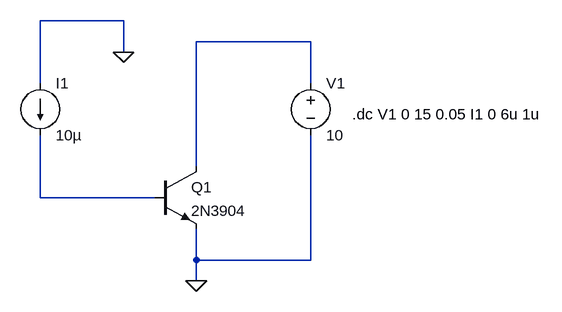
[diagram p0: schematic BJT_IV_trace copy.asc]
BJT_IV_trace copy.asc, the LTspice schematic file:
Version 4
SHEET 1 1000 680
WIRE 272 176 144 176
WIRE 560 208 384 208
WIRE 272 224 272 176
WIRE 144 272 144 176
WIRE 560 272 560 208
WIRE 384 400 384 208
WIRE 144 448 144 352
WIRE 320 448 144 448
WIRE 384 544 384 496
WIRE 560 544 560 352
WIRE 560 544 384 544
WIRE 384 576 384 544
FLAG 384 576 0
FLAG 272 224 0
SYMBOL current 144 272 R0
SYMATTR InstName I1
SYMATTR Value 10µ
SYMBOL Voltage 560 256 R0
SYMATTR InstName V1
SYMATTR Value 10
SYMBOL npn 320 400 R0
SYMATTR InstName Q1
SYMATTR Value 2N3904
TEXT 624 320 Left 2 !.dc V1 0 15 0.05 I1 0 6u 1u

The netlist it stands for:
* BJT_IV_trace copy.asc
I1 0 N002 10µ
V1 N001 0 10
Q1 N001 N002 0 0 2N3904
.model NPN NPN
.model PNP PNP
.lib standard.bjt
.dc V1 0 15 0.05 I1 0 6u 1u
.backanno
.end